# EAGLE design Adafruit LPS28 Pressure Sensor (EAGLE 9.6.2)
COMPANY: ADAFRUIT INDUSTRIES; DRAWN: KTOWN; REV: A
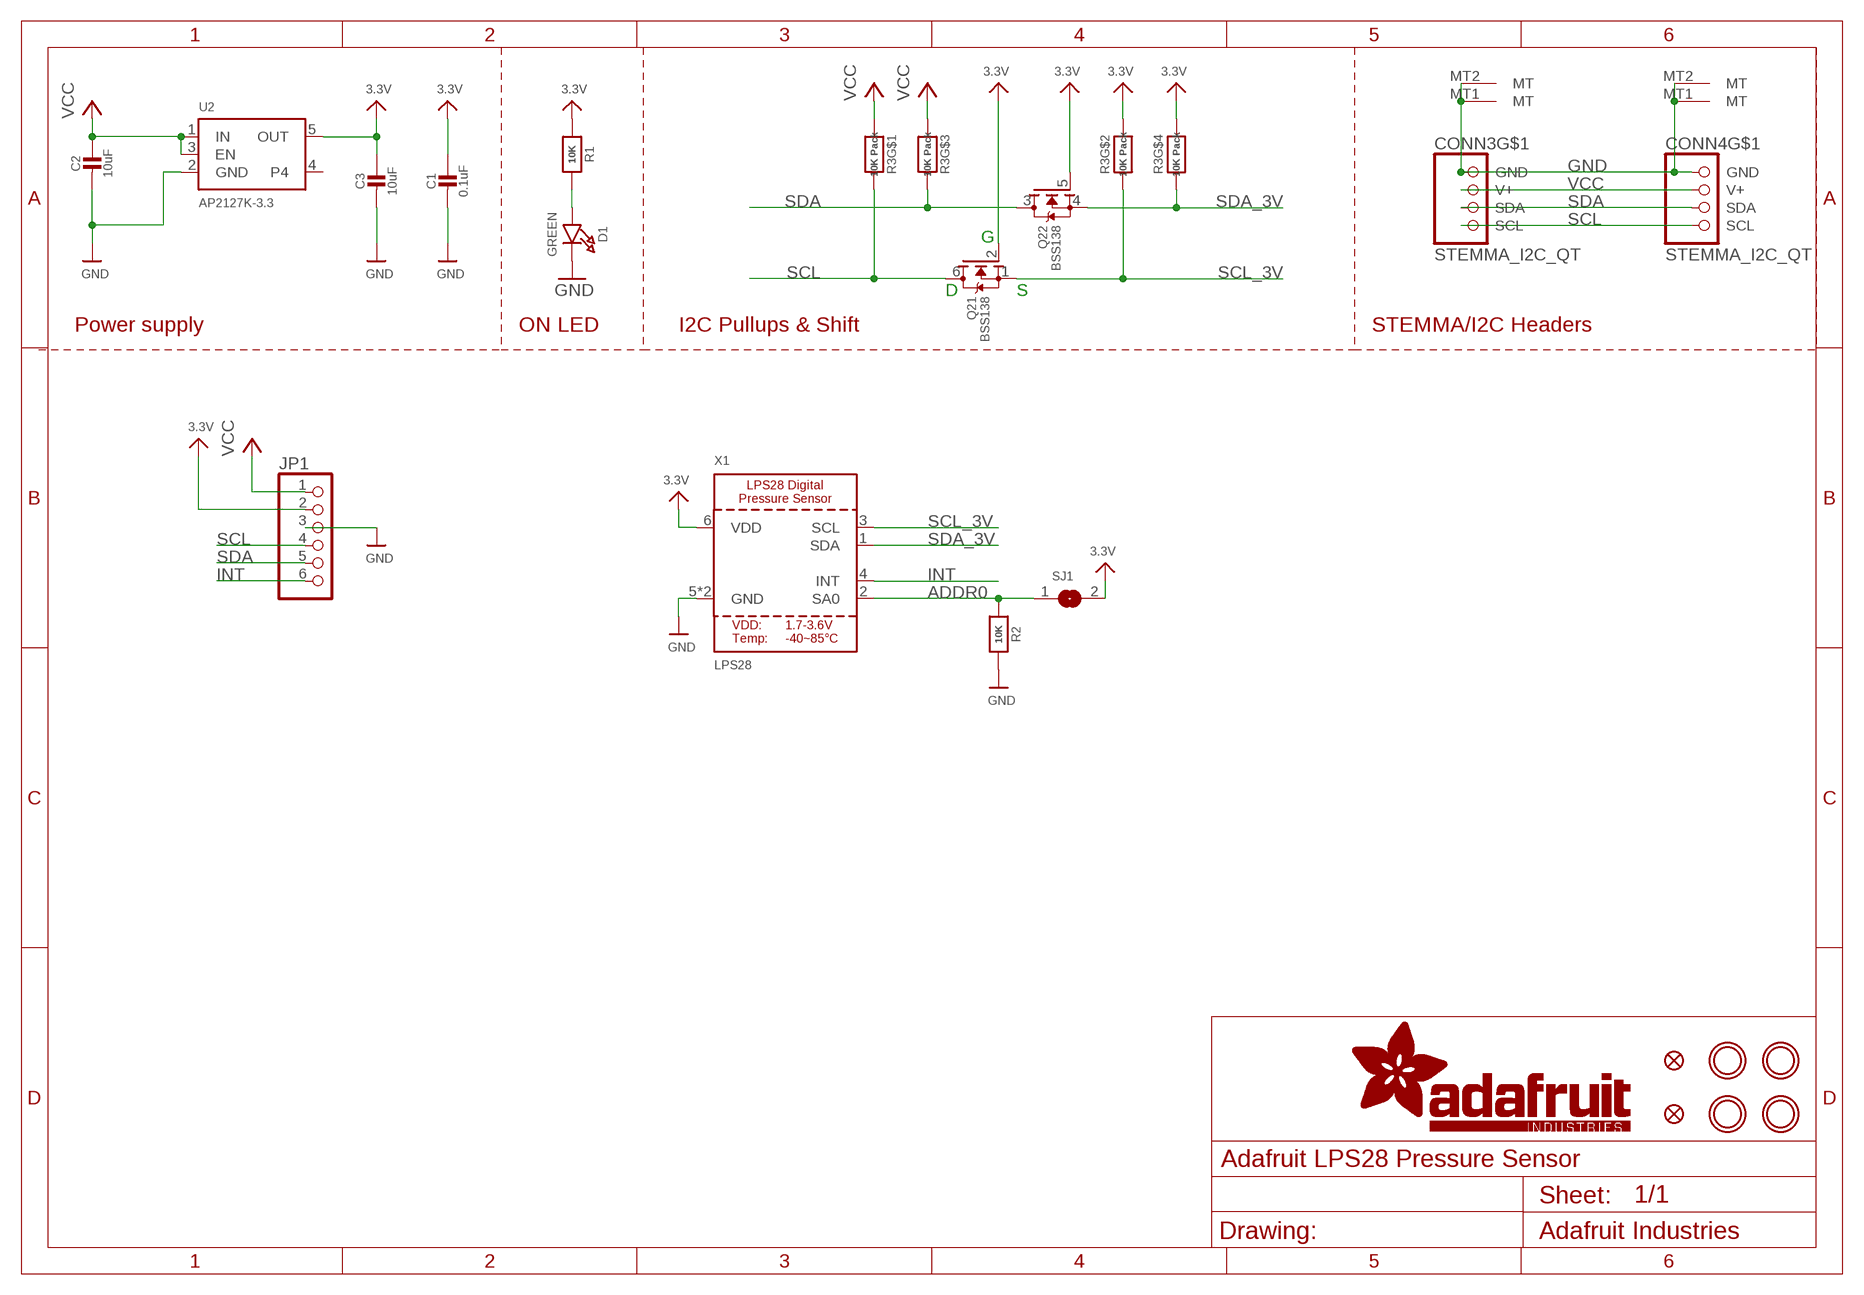
[diagram p0: schematic, sheet 1]

## Parts
C1  0.1uF  CAP_CERAMIC0603_NO  [0603-NO]
C2  10uF  CAP_CERAMIC0805-NOOUTLINE  [0805-NO]
C3  10uF  CAP_CERAMIC0805-NOOUTLINE  [0805-NO]
CONN3  STEMMA_I2C_QT  [JST_SH4]
CONN4  STEMMA_I2C_QT  [JST_SH4]
D1  GREEN  LED0603_NOOUTLINE  [CHIPLED_0603_NOOUTLINE]
FID3  FIDUCIAL_1MM  [FIDUCIAL_1MM]
FID4  FIDUCIAL_1MM  [FIDUCIAL_1MM]
JP1  HEADER-1X670MIL  [1X06_ROUND_70]
Q2  BSS138  MOSFET-N_DUAL  [SOT363]
R1  10K  RESISTOR_0603_NOOUT  [0603-NO]
R2  10K  RESISTOR_0603_NOOUT  [0603-NO]
R3  10K Pack  RESISTOR_4PACK  [RESPACK_4X0603]
SJ1  SOLDERJUMPER  [SOLDERJUMPER_ARROW_NOPASTE]
U2  AP2127K-3.3  VREG_SOT23-5  [SOT23-5]
U$1  MOUNTINGHOLE2.5  [MOUNTINGHOLE_2.5_PLATED]
U$17  MOUNTINGHOLE2.5  [MOUNTINGHOLE_2.5_PLATED]
U$19  MOUNTINGHOLE2.5  [MOUNTINGHOLE_2.5_PLATED]
U$21  MOUNTINGHOLE2.5  [MOUNTINGHOLE_2.5_PLATED]
X1  LPS28  [LPS28]

## Nets
3.3V [lowpower]: C1.1 C3.1 JP1.2 Q2.2(1:G) Q2.5(2:G) R1.1 R3.2 R3.4 SJ1.2 U2.5(OUT) X1.6(VDD)
ADDR0: R2.1 SJ1.1 X1.2(SA0)
GND [highpower]: C1.2 C2.2 C3.2 CONN3.1(GND) CONN3.MT1(MT) CONN3.MT2(MT) CONN4.1(GND) CONN4.MT1(MT) CONN4.MT2(MT) D1.C JP1.3 R2.2 U2.2(GND) X1.5(GND) X1.7(GND)
INT: JP1.6 X1.4(INT)
N$1: D1.A R1.2
SCL: CONN3.4(SCL) CONN4.4(SCL) JP1.4 Q2.6(1:D) R3.8
SCL_3V: Q2.1(1:S) R3.7 X1.3(SCL)
SDA: CONN3.3(SDA) CONN4.3(SDA) JP1.5 Q2.3(2:D) R3.6
SDA_3V: Q2.4(2:S) R3.5 X1.1(SDA)
VCC [highpower]: C2.1 CONN3.2(V+) CONN4.2(V+) JP1.1 R3.1 R3.3 U2.1(IN) U2.3(EN)
Unconnected: U2.4

## Notes on the sheet
- G
- D | S
- Power supply | ON LED | I2C Pullups & Shift | STEMMA/I2C Headers

## Library data of the parts
C1-C3 = microbuilder:CAP_CERAMIC: Ceramic Capacitors For new designs, use the packages preceded by an '_' character since they are more reliable: The following footprints should be used on most boards: _0402 - Standard footprint for regular board layouts _0603 - Standard footprint for regular board layouts _0805 - Standard footprint for regular board layouts _1206 - Standard footprint for regular board layouts For extremely tight-pitch boards where space is at a premium, the following 'micro-pitch' footprints can be used (smaller pads, no silkscreen outline, etc.): _0402MP - Micro-pitch footprint for very dense/compact boards _0603MP - Micro-pitch footprint for very dense/compact boards _0805MP - Micro-pitch footprint for very dense/compact boards _1206MP - Micro-pitch footprint for very dense/compact boards
CONN3 CONN4 = adafruit_electromech:STEMMA_I2C; LCSC: C2845363
D1 = microbuilder:LED: LED 0603 - 0603 Surface Mount Package 2mA: Green LED - Low Power (3.9mcd, 2ma, 1.7Vf) - Digikey: 475-2709-2-ND Orange LED - Low Power (9.8mcd, 2ma, 1.8Vf) - Digikey: 475-1194-2-ND Red LED - Low Power (5mcd, 2ma, 1.8Vf) - Digikey: 475-1195-2-ND Yellow LED - Low Power (7mcd, 2ma, 1.8Vf) - Digikey: 475-1196-2-ND 5mA: Blue LED - Low Power (17mcd, 5ma, 2.9Vf) - Digikey: LNJ937W8CRACT-ND 0805 - 0805 Surface Mount Package 2mA: Red LED (8.8mcd, 2mA, 1.8Vf, Clear) - Low Power [Digikey: 475-2510-1-ND] Green LED (5mcd, 2mA, 1.8Vf, Clear) - Low Power [Digikey: 475-2730-1-ND] Yellow LED (11.3mcd, 2mA, 1.8Vf, Clear) - Low Power [Digikey: 475-2555-1-ND] 20mA: Red LED (104mcd, 20mA, Diffused) - LS R976 [Digikey: 475-1278-6-ND] Red LED (12mcd, 20mA, 2.0Vf, Clear) - APT2012EC [Digikey: 754-1128-1-ND] Green LED (15mcd, 20mA, 2.2Vf, Clear) - APT2012GC [Digikey: 754-1131-1-ND] Orange LED (160mcd, 20mA, 2.1Vf, Clear) - APT2012SECK [Digikey: 754-1130-1-ND] 1206 - 1206 Surface Mount Package Green LED (26mcd, 20mA, Diffused) - LG N971 [Digikey: 475-1407-6-ND] Red LED (15mcd, 20mA, Diffused) - LH N974 [Digikey: 475-1416-6-ND] Cree - Cree High-Power Surface Mount LEDs XPEBWT-L1-0000-00D50 - White 111lm 350mA 2.9Vf 6200K 110° XTEAWT-00-0000-00000LEE3 - White 114lm 350mA 2.85Vf 5000K 115° Everlight - Everlight 45-21 Series Surface Mount LEDs 45-21/QK2C-B2832AC2CB2/2T - Warm White 2000mcd 20mA 3.25Vf 3050K 120° 45-21/LK2C-B38452C4CB2/2T - Nuetral White 2000mcd 20mA 3.25Vf 4150K 120° 45-21/LK2C-B50634C6CB2/2T - Cold White 2200mcd 20mA 3.25Vf 5650K 120° PLCC2 Reverse Mount LS T77K-J1L2-1-0-2-R18-Z - Red 11.25mcd 2mA 1.8Vf 630nm 120° LO T77K-L1M2-24-Z - Orange 19.6mcd 2mA 1.8Vf 606nm 120° LY T77K-K2M1-26-Z - Yellow 15.7mcd 2mA 1.8Vf 587nm 120°; ROT: 270
FID3 FID4 = microbuilder:FIDUCIAL: Fiducial Alignment Points Various fiducial points for machine vision alignment.; BOM: EXCLUDE
JP1 = microbuilder:HEADER-1X6: PIN HEADER
Q2 = microbuilder:MOSFET-N_DUAL: Dual N-Channel MOSFET SOT363 (2.0x1.25mm) 2N7002PS - 60V, 320mA [Digikey: 568-5984-1-ND]; JLC_ROTATION: 270
R1 R2 = microbuilder:RESISTOR: Resistors For new designs, use the packages preceded by an '_' character since they are more reliable: The following footprints should be used on most boards: _0402 - Standard footprint for regular board layouts _0603 - Standard footprint for regular board layouts _0805 - Standard footprint for regular board layouts _1206 - Standard footprint for regular board layouts For extremely tight-pitch boards where space is at a premium, the following 'micro-pitch' footprints can be used (smaller pads, no silkscreen outline, etc.): _0402MP - Micro-pitch footprint for very dense/compact boards _0603MP - Micro-pitch footprint for very dense/compact boards _0805MP - Micro-pitch footprint for very dense/compact boards _1206MP - Micro-pitch footprint for very dense/compact boards
R3 = microbuilder:RESISTOR_4PACK: Resistor Packs (4 resistors) 4 x 0603 10K 1/16W - Digikey: YC164J-10KCT-ND
SJ1 = microbuilder:SOLDERJUMPER: SMD Solder JUMPER Solder the two pads together to create a connection, or remove the solder to break it. REFLOW - Use this footprint for solder paste and reflow ovens. WAVE - Use this footprint for hand-soldering (larger pads). CLOSED - Has a trace between the two pads to ensure it is closed by default. The trace needs to be cut to disable the jumper, and can be closed again by creating a solder bridge between the two pads.; BOM: EXCLUDE
U2 = adafruit_power:VREG_SOT23-5: SOT23-5 Fixed Voltage Regulators Part Current Out V Out V In V Dropout θJA (°C/W) TJ (°C) Digikey Part No. ADP121 150mA 3.3V 3.4-5.5V 0.09V @ 150mA -- -- ADP121-AUJZ33R7CT-ND ADP121 150mA 3.0V 3.1-5.5V 0.09V @ 150mA -- -- ADP121-AUJZ30R7CT-ND ADP122 300mA 3.3V 3.4-5.5V 0.085V @ 300mA -- -- ADP122AUJZ-3.3-R7CT-ND ADP1712 300mA 3.3V 3.5-5.5V 0.17V @ 300mA -- -- ADP1712AUJZ-3.3-R7TR-ND AP7311 (Low Cost) 150mA 3.3V 3.5-6V 0.15V @ 150mA -- -- AP7311-33WG-7DICT-ND LD39015M18R 150mA 1.8V 1.9V-5.5V 0.08V @ 100mA -- -- 497-6977-1-ND LP2985A-33DBVR 150mA 3.3V 3.3-16V 0.28V @ 150mA 206 150 296-18479-1-ND MCP1824T-3302E/OT 300mA 3.3V 3.5V-6V 0.2V @ 300mA -- -- MCP1824T-3302E/OTCT-ND MIC5205-2.5YM5 TR 150mA 2.5V 2.7-16V 0.165V @ 150mA -- -- 576-1257-2-ND MIC5205-3.0YM5 TR 150mA 3.0V 3.2V-16V 0.165V @ 150mA -- -- 576-1258-2-ND MIC5205-3.3YM5 TR 150mA 3.3V 3.5V-16V 0.165V @ 150mA -- -- 576-1259-2-ND TPS780330220 150mA 3.3V+2.2V 3.6-5.5V 250mV Max -- -- 296-23332-1-ND TDA3663/N1,135 100mA 3.3V 3.5-45V 0.18V @ 50mA -- -- 568-5343-1-ND Max operating temp can be calculated using θJA, TJ (max junction temperature), and power in watts. Set the "Maximum Ambient Temperature" until it reaches TJ ("Max Junction Temperature"), which is the absolute limit for safe use of the regulator: Heat Sink Temperature Calculator <http://www.daycounter.com/Calculators/Heat-Sink-Temperature-Calculator.phtml> For example, With 12V source into a 3.3V LP2985 and a 30mA load, we are dissipating (12V-3.3V) * 0.03A = 0.261W. With a θJA of 206 °C/W, a TJ of 150°C, and 261mW we can safely use the chip without a heat sink up to 75°C (=147.1°C Junction Temperature).; JLC_ROTATION: 270
U$1 U$17 U$19 U$21 = adafruit_electromech:MOUNTINGHOLE: Mounting Hole For #2 screws (0.086"/2.18mm width, 0.094"/2.4mm hole) use 2.5mm; BOM: EXCLUDE
X1 = adafruit_sensor:LPS28

## Net classes
1 highpower: width 0.305 mm, drill 0.483 mm
2 lowpower: width 0.254 mm, drill 0.483 mm

## Board
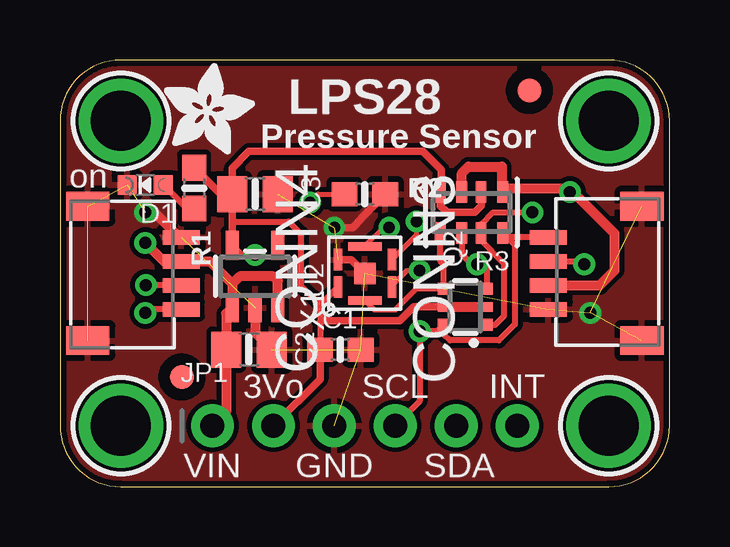
[diagram p1: board, top side]
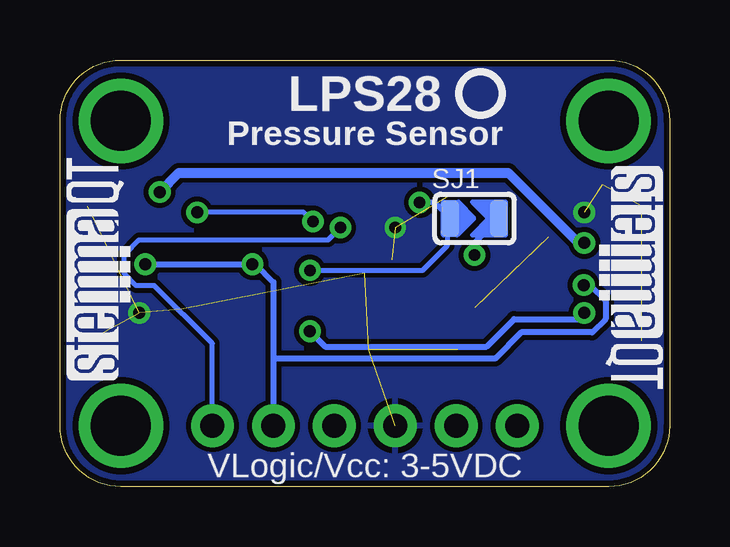
[diagram p2: board, bottom side, seen from below]

Size 25.4 x 17.78 mm. Coordinates in mm from the lower left corner, seen from the top.
Outline: 0,15.24 0,2.54 arc90 2.54,0 22.86,0 arc90 25.4,2.54 25.4,15.24 arc90 22.86,17.78 2.54,17.78 arc90 0,15.24
Copper layers (1*16): Top 0.035mm / dielectric 1.5mm / Bottom 0.035mm
Design rules "adafruit *": minimum track width 8mil, minimum drill 15.5mil, track to track 8mil, track to pad 8mil, pad to pad 8mil, via to via 8mil, smd to smd 8mil, copper to edge 10mil, drill to drill 8mil, minimum pad ring 10mil, minimum via ring 8mil, stop-mask expansion 2mil, vias tented up to drill 20mil, thermal gap 10mil

### Footprints (pad centres in the part's own frame; a part is rotated, then mirrored left to right if it is on the bottom)
0603-NO = smd 1.075 x 1: 1 -0.85,0; 2 0.85,0
0805-NO = smd 1.24 x 1.5: 1 -0.95,0; 2 0.95,0
JST_SH4 = smd 0.6 x 1.55: 1 -1.5,2.006; 2 -0.5,2.006; 3 0.5,2.006; 4 1.5,2.006 | smd 1.2 x 1.8: MT1 -2.8,-1.894; MT2 2.8,-1.894
CHIPLED_0603_NOOUTLINE = smd 0.8 x 0.8: A 0,-0.75; C 0,0.75
FIDUCIAL_1MM = smd 1 x 1: 1 0,0
1X06_ROUND_70 = drill 1 pad 1.778: 1 -6.35,0; 2 -3.81,0; 3 -1.27,0; 4 1.27,0; 5 3.81,0; 6 6.35,0
SOT363 = smd 0.5 x 0.5: 1 -0.75,-0.9; 3 0.75,-0.9; 4 0.75,0.9; 6 -0.75,0.9 | smd 0.4 x 0.5: 2 0,-0.9; 5 0,0.9
RESPACK_4X0603 = smd 0.45 x 0.9: 1 -1.3,-0.85; 2 -0.4,-0.85; 3 0.4,-0.85; 4 1.3,-0.85; 5 1.3,0.85; 6 0.4,0.85; 7 -0.4,0.85; 8 -1.3,0.85
SOLDERJUMPER_ARROW_NOPASTE = smd 0.762 x 1.524: 1 -1.016,0; 2 1.016,0
SOT23-5 = smd 0.55 x 1.2: 1 -0.95,-1.3; 2 0,-1.3; 3 0.95,-1.3; 4 0.95,1.3; 5 -0.95,1.3
MOUNTINGHOLE_2.5_PLATED = drill 2.5 pad 3.2: P$1 0,0
LPS28 = smd 0.35 x 1.4: 1 -1.125,0; 4 1.125,0 | smd 0.9 x 0.35: 2 -0.575,-1.125; 3 0.575,-1.125; 5 0.575,1.125; 6 -0.575,1.125 | smd 0.9 x 0.9: 7 0,0

### Placement (x,y rotation side)
C1  11.68,5.71 0 top
C2  7.87,5.71 0 top
C3  8.13,12.19 0 top
CONN3  22.35,8.89 90 top
CONN4  3.05,8.89 270 top
D1  3.56,12.57 90 top
FID3  5.08,4.57 0 top
FID4  19.56,16.51 0 top
JP1  12.7,2.54 0 top
Q2  16.89,7.49 90 top
R1  5.59,12.45 270 top
R2  12.7,12.19 0 top
R3  17.14,11.43 180 top
SJ1  8.13,11.18 0 bottom
U2  8.13,8.76 0 top
U$1  2.54,15.24 0 top
U$17  22.86,15.24 0 top
U$19  2.54,2.54 0 top
U$21  22.86,2.54 0 top
U$22  [ADAFRUIT_3.5MM]  4.32,13.84 0 top
U$25  [PCBFEAT-REV-040]  7.87,16.38 0 bottom
U$30  [STEMMAQT]  22.48,4.45 90 bottom
U$31  [STEMMAQT]  2.92,13.34 270 bottom
X1  12.7,8.89 90 top

### Tracks (layer width: path | path; a pad name or v marks a point on that pad's centre or on a via)
3.3V  (via drill 0.48)
  Top 0.254: X1.6 10.84,7.58 | 10.84,7.58 10.83,7.57 10.83,6.86 C1.1 | 7.18,11.05 9.53,11.05 10.03,10.54 10.03,8.38 10.84,7.58 | v8.13,9.65 7.59,9.65 U2.5
  Top 0.305: R3.2 17.55,11.7 17.27,11.43 16.13,11.43 15.85,11.71 R3.4 15.88,12.31 15.88,13.21 15.11,13.97 7.87,13.97 7.18,13.27 C3.1 | C3.1 7.18,11.05 U2.5 | R1.1 6.69,12.19 C3.1 | C1.1 10.83,4.48 JP1.2 | Q2.5 14.74,7.49 14.16,6.91 10.88,6.91 10.83,6.86
  Top 0.406: Q2.5 Q2.2
  Bottom 0.254: SJ1.2 8.13,10.16 v8.13,9.65
ADDR0  (via drill 0.48)
  Top 0.203: X1.2 13.82,8.36 14.48,9.02 v14.99,9.02 | v10.41,11.85 10.76,12.19 R2.1
  Bottom 0.203: v14.99,9.02 10.29,9.02 9.27,10.03 9.27,11.34 9.78,11.85 v10.41,11.85 9.82,11.85 SJ1.1
GND  (via drill 0.48, 0.5)  (13 unrouted)
  Top 0.305: X1.5 12.12,9.46 X1.7 | R2.2 12.57,11.21 12.57,11.18 12.19,10.79 v11.43,10.79
  Top 0.406: U2.2 8.13,6.41 C2.2 | CONN4.1 5.05,10.31 3.94,11.43 v3.56,11.43
  other vias: 22.1,7.24
  pour Top: 0,17.78 25.4,17.78 25.4,0 0,0
  pour Bottom: 0,17.78 25.4,17.78 25.4,0 0,0
INT  (via drill 0.48)
  Top 0.203: v13.72,10.79 13.48,10.79 X1.4
  Bottom 0.203: JP1.6 19.05,5.97 21.46,8.38 22.23,8.38 22.73,8.89 22.73,9.65 22.1,10.29 14.22,10.29 v13.72,10.79
N$1
  Top 0.254: D1.A 5.28,11.6 R1.2
SCL  (via drill 0.5)
  Top 0.254: CONN3.4 18.64,10.39 R3.8 18.95,10.07 18.95,6.76 18.29,6.1 16.26,6.1 15.99,6.36 Q2.6 15.72,6.48 v14.99,6.48 14.99,3.56 JP1.4 | CONN4.4 3.71,7.39 v3.56,7.24
  Bottom 0.254: v14.99,6.48 14.35,5.84 7.62,5.84 6.48,6.99 3.58,6.99 3.56,7.01 v3.56,7.24
SCL_3V  (via drill 0.48, 0.5)
  Top 0.203: X1.3 14.86,10.5 v14.86,11.05
  Top 0.254: v19.68,11.43 18.03,11.43 17.55,10.94 R3.7 17.55,10.27 18.5,9.32 18.5,7.11 18.13,6.74 Q2.1
  Bottom 0.203: v14.86,11.05 15.24,11.43 v19.68,11.43
SDA  (via drill 0.5)
  Top 0.254: R3.6 16.75,9.69 17.16,9.27 v17.38,9.27 17.38,9.13 17.79,9.13 Q2.3 | CONN4.3 v3.58,8.39 v3.58,8.4 | CONN3.3 21.73,9.39 v21.84,9.27
  Bottom 0.254: v3.58,8.4 3.33,8.4 2.67,7.75 2.67,6.99 3.23,6.43 6.18,6.43 7.27,5.33 16.51,5.33 | v21.84,9.27 v17.38,9.27 17.25,9.27 16.51,8.53 16.51,5.33 | 16.51,5.33 JP1.5
SDA_3V
  Top 0.203: X1.1 13.1,7.37 13.97,7.37 14.85,8.24 Q2.4
  Top 0.254: Q2.4 15.99,9.26 15.85,9.4 R3.5
VCC  (via drill 0.5)
  Top 0.406: R3.3 16.75,13.06 17.02,13.34 18.41,13.34 18.41,12.31 R3.1 18.57,12.41 21.12,12.41 v21.25,12.28 21.38,12.28 23.11,10.54 23.11,9.02 22.49,8.39 CONN3.2 | U2.3 9.08,8.57 8.89,8.76 7.49,8.76 7.18,8.45 | 7.18,8.45 U2.1 6.92,7.21 C2.1 6.92,3.11 JP1.1 | 7.18,8.45 6.24,9.39 CONN4.2 4.33,9.39 v3.56,10.16
  Bottom 0.406: v21.25,12.28 20.45,13.08 6.73,13.08 3.81,10.16 v3.56,10.16

### Text on the board
tPlace: LPS28 | Pressure Sensor | on | 3Vo | SCL | INT | VIN | GND | SDA
bPlace: LPS28 | Pressure Sensor | VLogic/Vcc: 3-5VDC